# EAGLE design esp-prog-SMD (EAGLE 7.3.0)
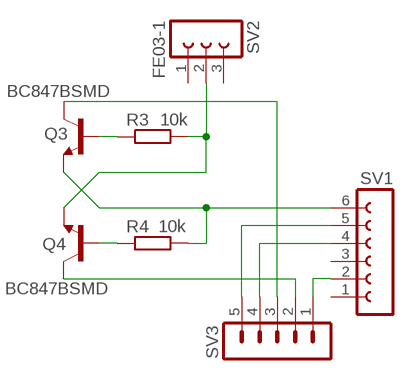
[diagram p0: schematic, sheet 1]

## Parts
Q3  BC847BSMD  [SOT23]
Q4  BC847BSMD  [SOT23]
R3  10k  R-EU_R1206  [R1206]
R4  10k  R-EU_R1206  [R1206]
SV1  FE06-1  [FE06]
SV2  FE03-1  [FE03-1]
SV3  MA05-1  [MA05-1]

## Nets
N$1: Q3.1(B) R3.1
N$2: Q4.1(B) R4.1
N$3: SV1.2 SV3.1
N$4: SV1.5 SV3.5
N$5: SV1.4 SV3.4
N$6: Q3.2(E) R4.2 SV1.6
N$7: Q4.2(E) R3.2 SV2.2
N$8: Q4.3(C) SV3.2
N$9: Q3.3(C) SV3.3
Unconnected: SV1.1 SV1.3 SV2.1 SV2.3

## Library data of the parts
Q3 Q4 = transistor-npn:BC847*: NPN Transistor
R3 R4 = rcl:R-EU_: RESISTOR, European symbol
SV1 = con-lsta:FE06-1: FEMALE HEADER; OC_FARNELL: unknown; OC_NEWARK: unknown
SV2 = con-lsta:FE03-1
SV3 = con-lstb:MA05-1: PIN HEADER; OC_FARNELL: unknown; OC_NEWARK: unknown

## Board
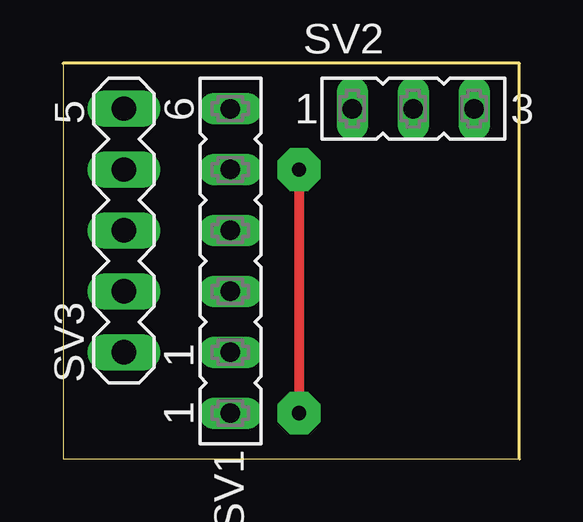
[diagram p1: board, top side]
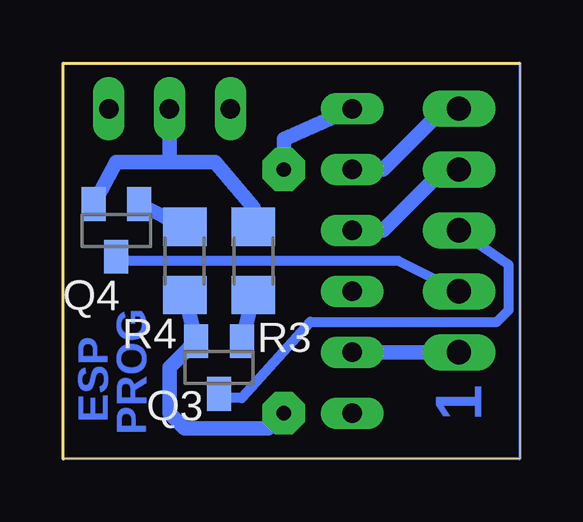
[diagram p2: board, bottom side, seen from below]

Size 19.04 x 16.5 mm. Coordinates in mm from the lower left corner, seen from the top.
Outline: 0,0 19.04,0 19.04,16.5 0,16.5 0,0
Copper layers (1*16): Top 0.035mm / dielectric 1.5mm / Bottom 0.035mm
Design rules "default": minimum track width 10mil, minimum drill 24mil, track to track 8mil, track to pad 8mil, pad to pad 8mil, via to via 8mil, smd to smd 8mil, copper to edge 40mil, drill to drill 8mil, minimum pad ring 10mil, minimum via ring 8mil, stop-mask expansion 4mil, vias tented up to drill 0mil, thermal gap 10mil

### Footprints (pad centres in the part's own frame; a part is rotated, then mirrored left to right if it is on the bottom)
SOT23 = smd 1 x 1.4: 1 -0.95,-1.1; 2 0.95,-1.1; 3 0,1.1
R1206 = smd 1.6 x 1.803: 1 -1.422,0; 2 1.422,0
FE06 = drill 0.813 long: 1 -6.35,0; 2 -3.81,0; 3 -1.27,0; 4 1.27,0; 5 3.81,0; 6 6.35,0
FE03-1 = drill 0.813 long: 1 -2.54,0; 2 0,0; 3 2.54,0
MA05-1 = drill 1.016 long: 1 -5.08,0; 2 -2.54,0; 3 0,0; 4 2.54,0; 5 5.08,0

### Placement (x,y rotation side)
Q3  12.54,3.81 180 bottom
Q4  16.83,9.53 180 bottom
R3  11.11,8.26 90 bottom
R4  13.97,8.26 270 bottom
SV1  6.99,8.26 90 top
SV2  14.61,14.61 0 top
SV3  2.54,9.53 90 top

### Tracks (layer width: path | path; a pad name or v marks a point on that pad's centre or on a via)
N$1
  Bottom 0.61: Q3.1 R3.1
N$2
  Bottom 0.61: Q4.1 R4.1
N$3
  Bottom 0.61: SV1.2 SV3.1
N$4
  Bottom 0.61: SV1.5 5.71,12.06 3.17,14.61 SV3.5
N$5
  Bottom 0.61: SV1.4 5.71,9.53 3.17,12.06 SV3.4
N$6  (via drill 0.6 pad 1.78)
  Top 0.406: v9.84,12.06 v9.84,1.91
  Bottom 0.61: R4.2 Q3.2 14.61,3.81 14.61,1.91 13.97,1.27 10.48,1.27 v9.84,1.91 | SV1.6 9.84,13.34 v9.84,12.06
N$7
  Bottom 0.406: 11.11,10.48 R3.2
  Bottom 0.61: Q4.2 16.83,12.38 14.61,12.38 | 14.61,12.38 12.7,12.38 11.11,10.48 | SV2.2 14.61,12.38
N$8
  Bottom 0.406: Q4.3 16.51,8.26 5.08,8.26 SV3.2
N$9
  Bottom 0.406: Q3.3 12.06,2.54 11.59,2.54 8.73,5.71 0.95,5.71 0.48,6.19 0.48,8.1 SV3.3
N$10
  Bottom 0.127: 0,0 19.05,0 19.05,16.51 0,16.51 0,0

### Text on the board
Bottom: PROG | ESP | 1